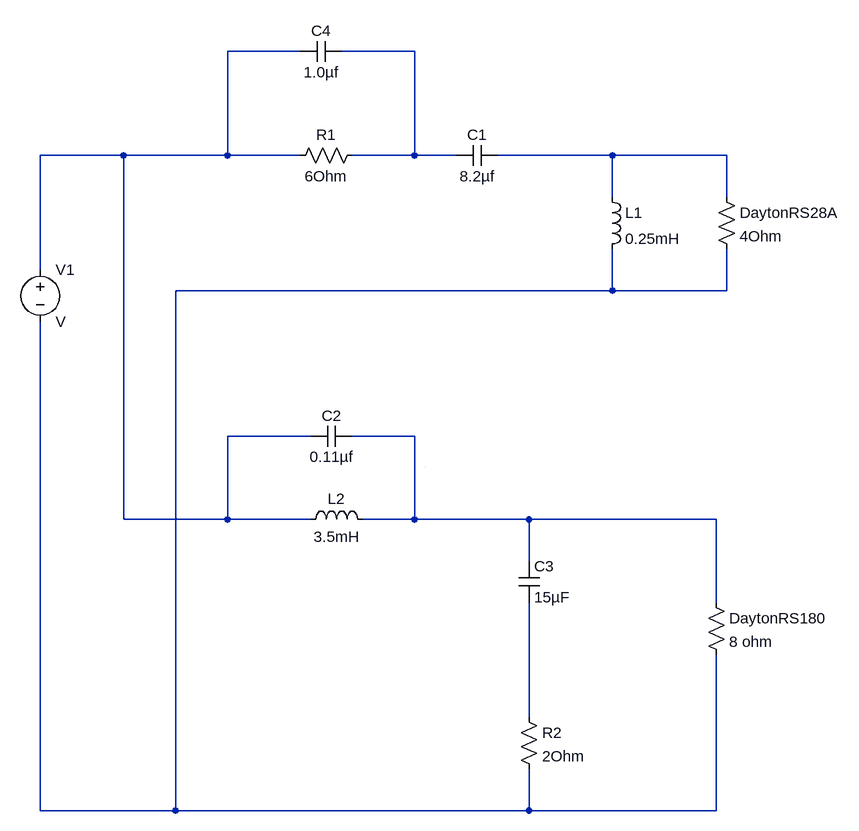
[diagram p0: schematic Core 2-way schematic.asc]
Core 2-way schematic.asc, the LTspice schematic file:
Version 4
SHEET 1 880 680
WIRE -192 -640 -304 -640
WIRE -16 -640 -128 -640
WIRE -464 -480 -592 -480
WIRE -304 -480 -304 -640
WIRE -304 -480 -464 -480
WIRE -192 -480 -304 -480
WIRE -16 -480 -16 -640
WIRE -16 -480 -112 -480
WIRE 48 -480 -16 -480
WIRE 288 -480 112 -480
WIRE 464 -480 288 -480
WIRE 288 -416 288 -480
WIRE 464 -416 464 -480
WIRE -592 -304 -592 -480
WIRE 288 -272 288 -336
WIRE 288 -272 -384 -272
WIRE 464 -272 464 -336
WIRE 464 -272 288 -272
WIRE -176 -48 -304 -48
WIRE -16 -48 -112 -48
WIRE -464 80 -464 -480
WIRE -304 80 -304 -48
WIRE -304 80 -464 80
WIRE -176 80 -304 80
WIRE -16 80 -16 -48
WIRE -16 80 -96 80
WIRE 160 80 -16 80
WIRE 448 80 160 80
WIRE 160 144 160 80
WIRE 448 208 448 80
WIRE 160 384 160 208
WIRE -592 528 -592 -224
WIRE -384 528 -384 -272
WIRE -384 528 -592 528
WIRE 160 528 160 464
WIRE 160 528 -384 528
WIRE 448 528 448 288
WIRE 448 528 160 528
WIRE 0 0 0 0
SYMBOL res 432 192 R0
SYMATTR InstName DaytonRS180
SYMATTR Value 8 ohm
SYMBOL res 144 368 R0
SYMATTR InstName R2
SYMATTR Value 2Ohm
SYMBOL res 448 -432 R0
SYMATTR InstName DaytonRS28A
SYMATTR Value 4Ohm
SYMBOL res -96 -496 R90
WINDOW 0 0 56 VBottom 2
WINDOW 3 32 56 VTop 2
SYMATTR InstName R1
SYMATTR Value 6Ohm
SYMBOL cap 144 144 R0
SYMATTR InstName C3
SYMATTR Value 15µF
SYMBOL cap -112 -64 R90
WINDOW 0 0 32 VBottom 2
WINDOW 3 32 32 VTop 2
SYMATTR InstName C2
SYMATTR Value 0.11µf
SYMBOL cap 112 -496 R90
WINDOW 0 0 32 VBottom 2
WINDOW 3 32 32 VTop 2
SYMATTR InstName C1
SYMATTR Value 8.2µf
SYMBOL cap -128 -656 R90
WINDOW 0 0 32 VBottom 2
WINDOW 3 32 32 VTop 2
SYMATTR InstName C4
SYMATTR Value 1.0µf
SYMBOL ind 272 -432 R0
SYMATTR InstName L1
SYMATTR Value 0.25mH
SYMBOL ind -192 96 R270
WINDOW 0 32 56 VTop 2
WINDOW 3 5 56 VBottom 2
SYMATTR InstName L2
SYMATTR Value 3.5mH
SYMBOL voltage -592 -320 R0
SYMATTR InstName V1

The netlist it stands for:
* Core 2-way schematic.asc
R§DaytonRS180 N005 N004 8 ohm
R2 N006 N004 2Ohm
R§DaytonRS28A N003 N004 4Ohm
R1 N002 N001 6Ohm
C3 N005 N006 15µF
C2 N005 N001 0.11µf
C1 N003 N002 8.2µf
C4 N002 N001 1.0µf
L1 N003 N004 0.25mH
L2 N001 N005 3.5mH
V1 N001 N004 V
.backanno
.end